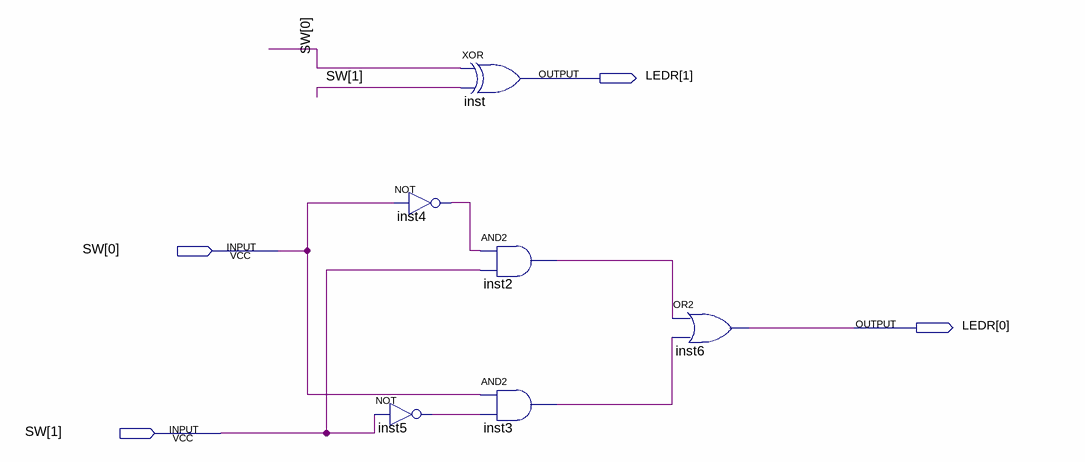
[diagram p0: schematic sheet]
// Quartus schematic aula01.bdf as structural Verilog: 6 symbols, 4 pins
module aula01 (
  input  [1:0] SW,
  output [1:0] LEDR
);

  wire inst2_out, inst3_out, inst4_out, inst5_out;

  not inst4 (inst4_out, SW[0]);
  not inst5 (inst5_out, SW[1]);
  xor inst (LEDR[1], SW[0], SW[1]);
  and inst2 (inst2_out, inst4_out, SW[1]);
  and inst3 (inst3_out, SW[0], inst5_out);
  or inst6 (LEDR[0], inst2_out, inst3_out);
endmodule
